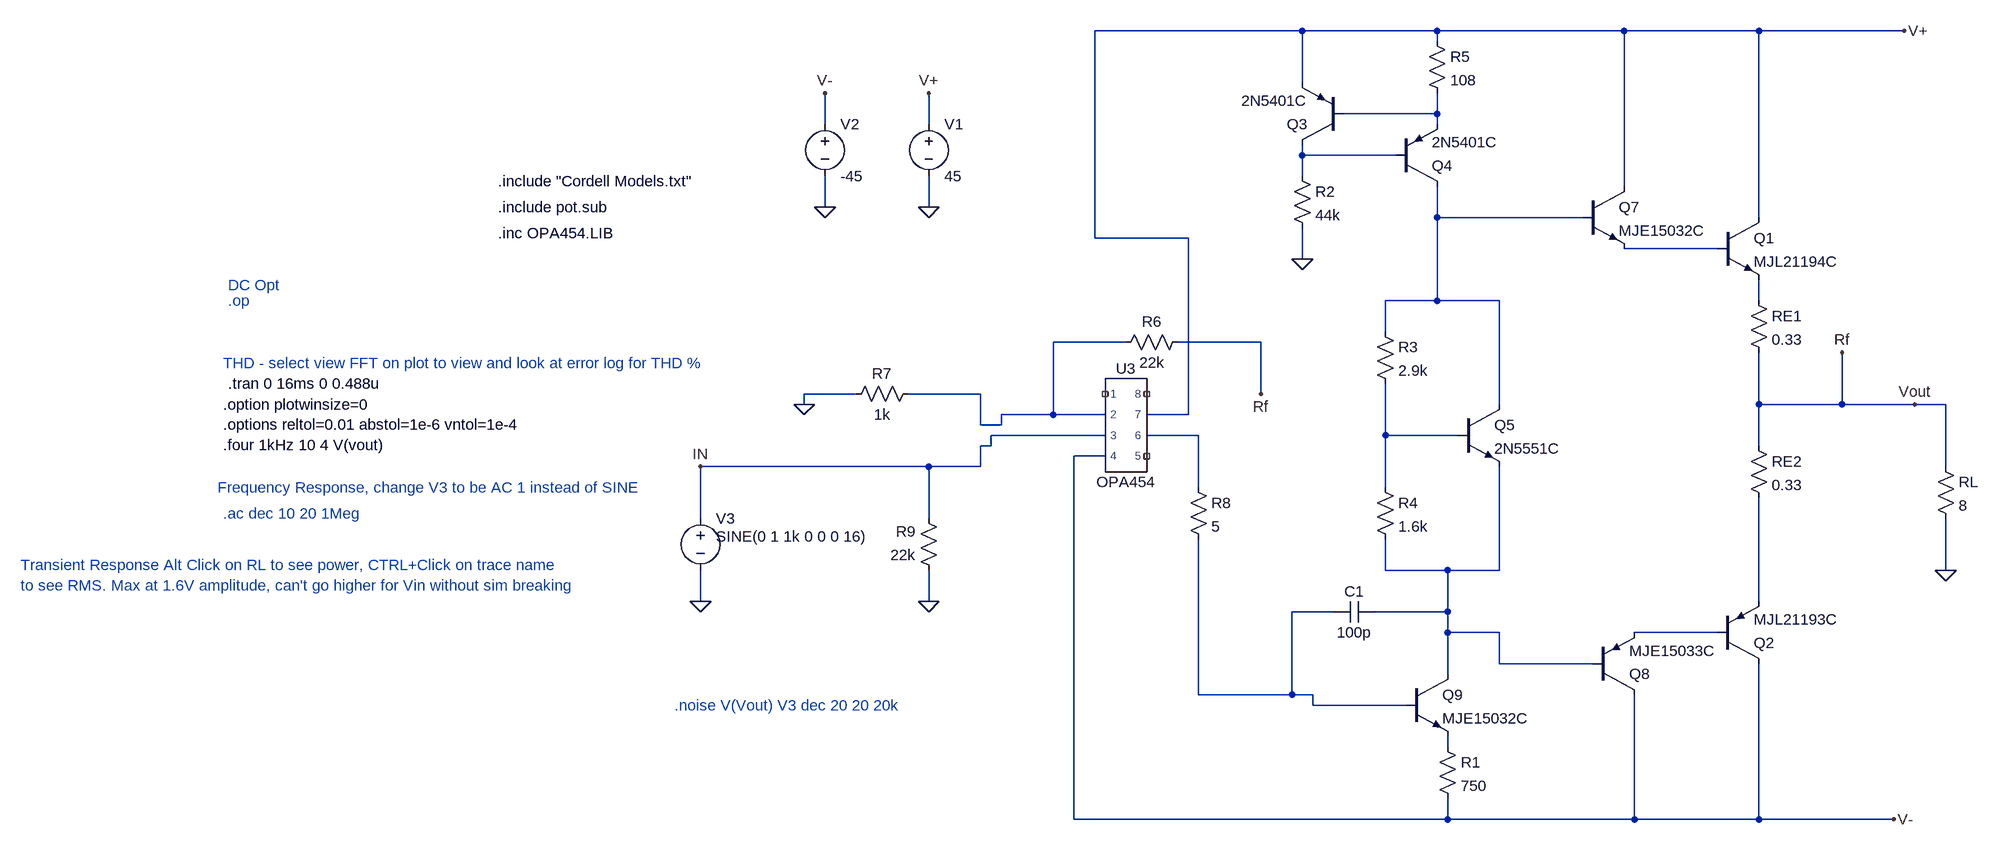
[diagram p0: schematic ABAmp_models85.asc]
ABAmp_models85.asc, the LTspice schematic file:
Version 4.1
SHEET 1 6816 1468
WIRE 608 192 288 192
WIRE 816 192 608 192
WIRE 1104 192 816 192
WIRE 1312 192 1104 192
WIRE 1536 192 1312 192
WIRE 816 208 816 192
WIRE 608 272 608 192
WIRE 816 320 816 288
WIRE 816 320 672 320
WIRE -128 336 -128 288
WIRE 32 336 32 288
WIRE 816 336 816 320
WIRE 608 384 608 368
WIRE 752 384 608 384
WIRE 608 416 608 384
WIRE 1104 432 1104 192
WIRE -128 464 -128 416
WIRE 32 464 32 416
WIRE 816 480 816 432
WIRE 1040 480 816 480
WIRE 1312 480 1312 192
WIRE 288 512 288 192
WIRE 432 512 288 512
WIRE 1248 528 1104 528
WIRE 608 544 608 496
WIRE 816 608 816 480
WIRE 816 608 736 608
WIRE 912 608 816 608
WIRE 1312 608 1312 576
WIRE 736 656 736 608
WIRE 336 672 224 672
WIRE 544 672 416 672
WIRE -80 752 -160 752
WIRE 112 752 0 752
WIRE 544 752 544 672
WIRE -160 768 -160 752
WIRE 912 768 912 608
WIRE 1312 768 1312 688
WIRE 1440 768 1440 688
WIRE 1440 768 1312 768
WIRE 1552 768 1440 768
WIRE 1600 768 1552 768
WIRE 224 784 224 672
WIRE 224 784 144 784
WIRE 304 784 224 784
WIRE 432 784 432 512
WIRE 432 784 368 784
WIRE 112 800 112 752
WIRE 144 800 144 784
WIRE 144 800 112 800
WIRE 304 816 128 816
WIRE 448 816 368 816
WIRE 736 816 736 736
WIRE 848 816 736 816
WIRE 128 832 128 816
WIRE 128 832 112 832
WIRE 1312 832 1312 768
WIRE 304 848 256 848
WIRE 32 864 -320 864
WIRE 112 864 112 832
WIRE 112 864 32 864
WIRE 1600 864 1600 768
WIRE 448 896 448 816
WIRE 736 896 736 816
WIRE -320 944 -320 864
WIRE 32 944 32 864
WIRE 736 1024 736 976
WIRE 832 1024 736 1024
WIRE 912 1024 912 864
WIRE 912 1024 832 1024
WIRE 1600 1024 1600 944
WIRE -320 1072 -320 1024
WIRE 32 1072 32 1024
WIRE 1312 1072 1312 912
WIRE 656 1088 592 1088
WIRE 832 1088 832 1024
WIRE 832 1088 720 1088
WIRE 832 1120 832 1088
WIRE 912 1120 832 1120
WIRE 1248 1120 1120 1120
WIRE 912 1168 912 1120
WIRE 1056 1168 912 1168
WIRE 832 1184 832 1120
WIRE 448 1216 448 976
WIRE 592 1216 592 1088
WIRE 592 1216 448 1216
WIRE 624 1216 592 1216
WIRE 624 1232 624 1216
WIRE 768 1232 624 1232
WIRE 832 1296 832 1280
WIRE 256 1408 256 848
WIRE 832 1408 832 1376
WIRE 832 1408 256 1408
WIRE 1120 1408 1120 1216
WIRE 1120 1408 832 1408
WIRE 1312 1408 1312 1168
WIRE 1312 1408 1120 1408
WIRE 1520 1408 1312 1408
FLAG 1600 1024 0
FLAG 1552 768 Vout
FLAG 32 1072 0
FLAG 544 752 Rf
FLAG 1440 688 Rf
FLAG 608 544 0
FLAG 32 464 0
FLAG -128 464 0
FLAG 32 288 V+
FLAG -128 288 V-
FLAG 1520 1408 V-
FLAG 1536 192 V+
FLAG -160 768 0
FLAG -320 1072 0
FLAG -320 864 IN
DATAFLAG 768 608 ""
DATAFLAG 768 1024 ""
DATAFLAG 1312 592 ""
DATAFLAG 1312 1008 ""
DATAFLAG 416 816 ""
DATAFLAG 256 816 ""
SYMBOL res 1296 592 R0
SYMATTR InstName RE1
SYMATTR Value 0.33
SYMBOL res 1296 816 R0
SYMATTR InstName RE2
SYMATTR Value 0.33
SYMBOL res 1584 848 R0
SYMATTR InstName RL
SYMATTR Value 8
SYMBOL res 720 640 R0
SYMATTR InstName R3
SYMATTR Value 2.9k
SYMBOL res 720 880 R0
SYMATTR InstName R4
SYMATTR Value 1.6k
SYMBOL npn 848 768 R0
SYMATTR InstName Q5
SYMATTR Value 2N5551C
SYMBOL cap 720 1072 R90
WINDOW 0 0 32 VBottom 2
WINDOW 3 32 32 VTop 2
SYMATTR InstName C1
SYMATTR Value 100p
SYMBOL res 432 656 R90
WINDOW 0 0 56 VBottom 2
WINDOW 3 32 56 VTop 2
SYMATTR InstName R6
SYMATTR Value 22k
SYMBOL res 48 1040 R180
WINDOW 0 36 76 Left 2
WINDOW 3 36 40 Left 2
SYMATTR InstName R9
SYMATTR Value 22k
SYMBOL res 16 736 R90
WINDOW 0 0 56 VBottom 2
WINDOW 3 32 56 VTop 2
SYMATTR InstName R7
SYMATTR Value 1k
SYMBOL npn 1248 480 R0
SYMATTR InstName Q1
SYMATTR Value MJL21194C
SYMBOL pnp 1248 1168 M180
SYMATTR InstName Q2
SYMATTR Value MJL21193C
SYMBOL res 592 400 R0
SYMATTR InstName R2
SYMATTR Value 44k
SYMBOL pnp 672 368 R180
SYMATTR InstName Q3
SYMATTR Value 2N5401C
SYMBOL pnp 752 432 M180
SYMATTR InstName Q4
SYMATTR Value 2N5401C
SYMBOL res 800 192 R0
SYMATTR InstName R5
SYMATTR Value 108
SYMBOL npn 1040 432 R0
SYMATTR InstName Q7
SYMATTR Value MJE15032C
SYMBOL pnp 1056 1216 M180
SYMATTR InstName Q8
SYMATTR Value MJE15033C
SYMBOL voltage 32 320 R0
WINDOW 123 0 0 Left 0
WINDOW 39 0 0 Left 0
SYMATTR InstName V1
SYMATTR Value 45
SYMBOL voltage -128 320 R0
WINDOW 123 0 0 Left 0
WINDOW 39 0 0 Left 0
SYMATTR InstName V2
SYMATTR Value -45
SYMBOL voltage -320 928 R0
WINDOW 123 24 44 Left 2
WINDOW 39 0 0 Left 0
WINDOW 3 24 44 Left 2
SYMATTR Value SINE(0 1 1k 0 0 0 16)
SYMATTR InstName V3
SYMBOL lib\\sym\\OPA454 336 800 R0
SYMATTR InstName U3
SYMBOL npn 768 1184 R0
SYMATTR InstName Q9
SYMATTR Value MJE15032C
SYMBOL res 816 1280 R0
SYMATTR InstName R1
SYMATTR Value 750
SYMBOL res 432 880 R0
SYMATTR InstName R8
SYMATTR Value 5
TEXT -632 464 Left 2 !.include pot.sub
TEXT -1048 608 Left 2 ;.op
TEXT -632 504 Left 2 !.inc OPA454.LIB
TEXT -632 424 Left 2 !.include "Cordell Models.txt"
TEXT -1048 736 Left 2 !.tran 0 16ms 0 0.488u
TEXT -1056 936 Left 2 ;.ac dec 10 20 1Meg
TEXT -1056 768 Left 2 !.option plotwinsize=0\n.options reltol=0.01 abstol=1e-6 vntol=1e-4\n.four 1kHz 10 4 V(vout)
TEXT -1048 584 Left 2 ;DC Opt
TEXT -1056 704 Left 2 ;THD - select view FFT on plot to view and look at error log for THD %
TEXT -1064 896 Left 2 ;Frequency Response, change V3 to be AC 1 instead of SINE
TEXT -1368 1016 Left 2 ;Transient Response Alt Click on RL to see power, CTRL+Click on trace name \nto see RMS. Max at 1.6V amplitude, can't go higher for Vin without sim breaking
TEXT -360 1232 Left 2 ;.noise V(Vout) V3 dec 20 20 20k

The netlist it stands for:
* ABAmp_models85.asc
RE1 N005 Rf 0.33
RE2 Rf N010 0.33
RL Rf 0 8
R3 N003 N008 2.9k
R4 N008 N009 1.6k
Q5 N003 N008 N009 0 2N5551C
C1 N009 N011 100p
R6 Rf N006 22k
R9 0 IN 22k
R7 N006 0 1k
Q1 V+ N004 N005 0 MJL21194C
Q2 V- N012 N010 0 MJL21193C
R2 N002 0 44k
Q3 N002 N001 V+ 0 2N5401C
Q4 N003 N002 N001 0 2N5401C
R5 V+ N001 108
Q7 V+ N003 N004 0 MJE15032C
Q8 V- N009 N012 0 MJE15033C
V1 V+ 0 45
V2 V- 0 -45
V3 IN 0 SINE(0 1 1k 0 0 0 16)
X§U3 IN N006 V+ V- N007 NC_01 NC_02 NC_03 OPA454  ; pins 3 2 7 4 6 8 1 5
Q9 N009 N011 N013 0 MJE15032C
R1 N013 V- 750
R8 N007 N011 5
.model NPN NPN
.model PNP PNP
.lib standard.bjt
.include pot.sub
* .op
.inc OPA454.LIB
.include "Cordell Models.txt"
.tran 0 16ms 0 0.488u
* .ac dec 10 20 1Meg
.option plotwinsize=0
.options reltol=0.01 abstol=1e-6 vntol=1e-4
.four 1kHz 10 4 V(vout)
* DC Opt
* THD - select view FFT on plot to view and look at error log for THD %
* Frequency Response, change V3 to be AC 1 instead of SINE
* Transient Response Alt Click on RL to see power, CTRL+Click on trace name
* to see RMS. Max at 1.6V amplitude, can't go higher for Vin without sim breaking
* .noise V(Vout) V3 dec 20 20 20k
.lib C:\Users\vrfri\OneDrive\Documents\LTspice\OPA454.LIB
.backanno
.end